# Altium schematic sheet 2-PWR_MANAGE.SchDoc
size A4
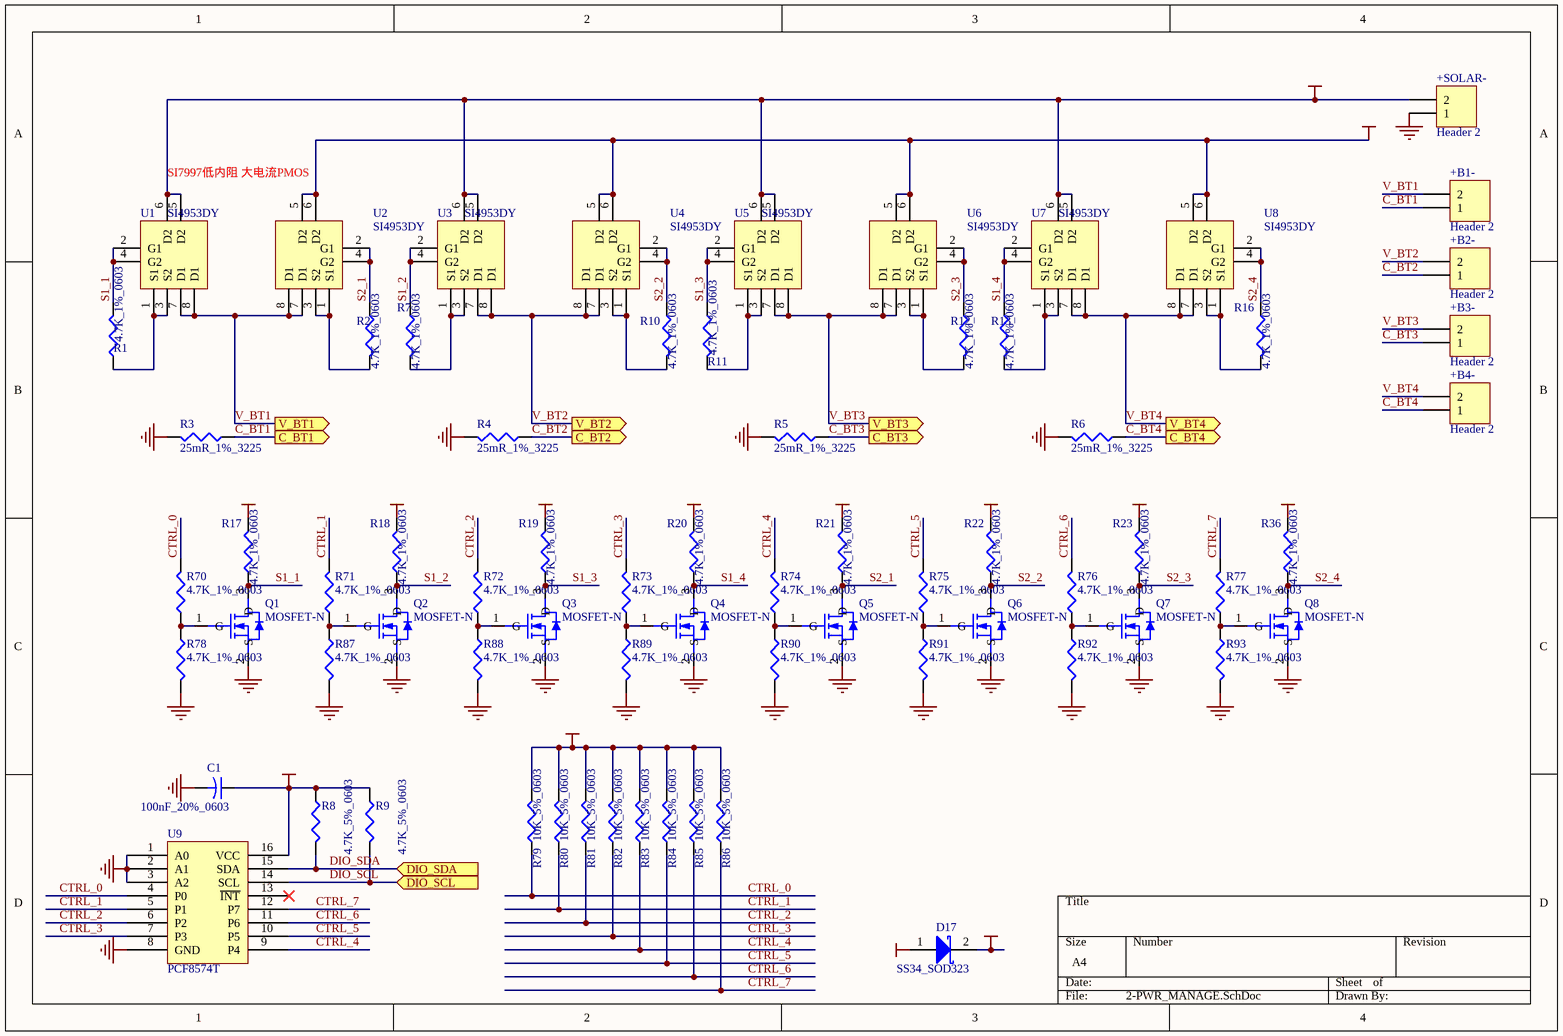
[diagram p0: 2-PWR_MANAGE.SchDoc]

## Parts
+B1-  Header 2  [VH-02H]
+B2-  Header 2  [VH-02H]
+B3-  Header 2  [VH-02H]
+B4-  Header 2  [VH-02H]
+SOLAR-  Header 2  [VH-02H]
C1  100nF_20%_0603  [C1608-0603]
D17  SS34_SOD323  [LED0805]
Q1  MOSFET-N  [SO-G3/C2.5]
Q2  MOSFET-N  [SO-G3/C2.5]
Q3  MOSFET-N  [SO-G3/C2.5]
Q4  MOSFET-N  [SO-G3/C2.5]
Q5  MOSFET-N  [SO-G3/C2.5]
Q6  MOSFET-N  [SO-G3/C2.5]
Q7  MOSFET-N  [SO-G3/C2.5]
Q8  MOSFET-N  [SO-G3/C2.5]
R1  4.7K_1%_0603  [C1608-0603]
R2  4.7K_1%_0603  [C1608-0603]
R3  25mR_1%_3225  [CR6332-2512]
R4  25mR_1%_3225  [CR6332-2512]
R5  25mR_1%_3225  [CR6332-2512]
R6  25mR_1%_3225  [CR6332-2512]
R7  4.7K_1%_0603  [C1608-0603]
R8  4.7K_5%_0603  [C1608-0603]
R9  4.7K_5%_0603  [C1608-0603]
R10  4.7K_1%_0603  [C1608-0603]
R11  4.7K_1%_0603  [C1608-0603]
R12  4.7K_1%_0603  [C1608-0603]
R13  4.7K_1%_0603  [C1608-0603]
R16  4.7K_1%_0603  [C1608-0603]
R17  4.7K_1%_0603  [C1608-0603]
R18  4.7K_1%_0603  [C1608-0603]
R19  4.7K_1%_0603  [C1608-0603]
R20  4.7K_1%_0603  [C1608-0603]
R21  4.7K_1%_0603  [C1608-0603]
R22  4.7K_1%_0603  [C1608-0603]
R23  4.7K_1%_0603  [C1608-0603]
R36  4.7K_1%_0603  [C1608-0603]
R70  4.7K_1%_0603  [C1608-0603]
R71  4.7K_1%_0603  [C1608-0603]
R72  4.7K_1%_0603  [C1608-0603]
R73  4.7K_1%_0603  [C1608-0603]
R74  4.7K_1%_0603  [C1608-0603]
R75  4.7K_1%_0603  [C1608-0603]
R76  4.7K_1%_0603  [C1608-0603]
R77  4.7K_1%_0603  [C1608-0603]
R78  4.7K_1%_0603  [C1608-0603]
R79  10K_5%_0603  [C1608-0603]
R80  10K_5%_0603  [C1608-0603]
R81  10K_5%_0603  [C1608-0603]
R82  10K_5%_0603  [C1608-0603]
R83  10K_5%_0603  [C1608-0603]
R84  10K_5%_0603  [C1608-0603]
R85  10K_5%_0603  [C1608-0603]
R86  10K_5%_0603  [C1608-0603]
R87  4.7K_1%_0603  [C1608-0603]
R88  4.7K_1%_0603  [C1608-0603]
R89  4.7K_1%_0603  [C1608-0603]
R90  4.7K_1%_0603  [C1608-0603]
R91  4.7K_1%_0603  [C1608-0603]
R92  4.7K_1%_0603  [C1608-0603]
R93  4.7K_1%_0603  [C1608-0603]
U1  SI4953DY  [SO-8]
U2  SI4953DY  [SO-8]
U3  SI4953DY  [SO-8]
U4  SI4953DY  [SO-8]
U5  SI4953DY  [SO-8]
U6  SI4953DY  [SO-8]
U7  SI4953DY  [SO-8]
U8  SI4953DY  [SO-8]
U9  PCF8574T  [SOP16_P1.27_B10]

## Ports
C_BT1 (out), C_BT2 (out), C_BT3 (out), C_BT4 (out), DIO_SCL (in), DIO_SDA (in), V_BT1 (out), V_BT2 (out), V_BT3 (out), V_BT4 (out)

## Nets
GND: +SOLAR-.1 C1.2 Q1.2(S) Q2.2(S) Q3.2(S) Q4.2(S) Q5.2(S) Q6.2(S) Q7.2(S) Q8.2(S) R3.2 R4.2 R5.2 R6.2 R78.2 R87.2 R88.2 R89.2 R90.2 R91.2 R92.2 R93.2 U9.1(A0) U9.2(A1) U9.3(A2) U9.8(GND)
VCC_3V3: C1.1 R8.1 R9.1 R79.2 R80.2 R81.2 R82.2 R83.2 R84.2 R85.2 R86.2 U9.16(VCC)
VCC_9V: D17.1(A)
VCC_BAT: U2.5(D2) U2.6(D2) U4.5(D2) U4.6(D2) U6.5(D2) U6.6(D2) U8.5(D2) U8.6(D2)
VCC_CHARGE: +SOLAR-.2 U1.5(D2) U1.6(D2) U3.5(D2) U3.6(D2) U5.5(D2) U5.6(D2) U7.5(D2) U7.6(D2)
VCC_TH: D17.2(K) R17.2 R18.2 R19.2 R20.2 R21.2 R22.2 R23.2 R36.2
C_BT1: +B1-.1 R3.1 ; port C_BT1
C_BT2: +B2-.1 R4.1 ; port C_BT2
C_BT3: +B3-.1 R5.1 ; port C_BT3
C_BT4: +B4-.1 R6.1 ; port C_BT4
CTRL_0: R70.2 R79.1 U9.4(P0)
CTRL_1: R71.2 R80.1 U9.5(P1)
CTRL_2: R72.2 R81.1 U9.6(P2)
CTRL_3: R73.2 R82.1 U9.7(P3)
CTRL_4: R74.2 R83.1 U9.9(P4)
CTRL_5: R75.2 R84.1 U9.10(P5)
CTRL_6: R76.2 R85.1 U9.11(P6)
CTRL_7: R77.2 R86.1 U9.12(P7)
DIO_SCL: R9.2 U9.14(SCL) ; port DIO_SCL
DIO_SDA: R8.2 U9.15(SDA) ; port DIO_SDA
S1_1: Q1.3(D) R1.2 R17.1 U1.2(G1) U1.4(G2)
S1_2: Q2.3(D) R7.1 R18.1 U3.2(G1) U3.4(G2)
S1_3: Q3.3(D) R11.1 R19.1 U5.2(G1) U5.4(G2)
S1_4: Q4.3(D) R13.1 R20.1 U7.2(G1) U7.4(G2)
S2_1: Q5.3(D) R2.1 R21.1 U2.2(G1) U2.4(G2)
S2_2: Q6.3(D) R10.1 R22.1 U4.2(G1) U4.4(G2)
S2_3: Q7.3(D) R12.1 R23.1 U6.2(G1) U6.4(G2)
S2_4: Q8.3(D) R16.1 R36.1 U8.2(G1) U8.4(G2)
V_BT1: +B1-.2 U1.7(D1) U1.8(D1) U2.7(D1) U2.8(D1) ; port V_BT1
V_BT2: +B2-.2 U3.7(D1) U3.8(D1) U4.7(D1) U4.8(D1) ; port V_BT2
V_BT3: +B3-.2 U5.7(D1) U5.8(D1) U6.7(D1) U6.8(D1) ; port V_BT3
V_BT4: +B4-.2 U7.7(D1) U7.8(D1) U8.7(D1) U8.8(D1) ; port V_BT4
NetQ1_1: Q1.1(G) R70.1 R78.1
NetQ2_1: Q2.1(G) R71.1 R87.1
NetQ3_1: Q3.1(G) R72.1 R88.1
NetQ4_1: Q4.1(G) R73.1 R89.1
NetQ5_1: Q5.1(G) R74.1 R90.1
NetQ6_1: Q6.1(G) R75.1 R91.1
NetQ7_1: Q7.1(G) R76.1 R92.1
NetQ8_1: Q8.1(G) R77.1 R93.1
NetR1_1: R1.1 U1.1(S1) U1.3(S2)
NetR2_2: R2.2 U2.1(S1) U2.3(S2)
NetR7_2: R7.2 U3.1(S1) U3.3(S2)
NetR10_2: R10.2 U4.1(S1) U4.3(S2)
NetR11_2: R11.2 U5.1(S1) U5.3(S2)
NetR12_2: R12.2 U6.1(S1) U6.3(S2)
NetR13_2: R13.2 U7.1(S1) U7.3(S2)
NetR16_2: R16.2 U8.1(S1) U8.3(S2)

Not connected (* = marked no-connect by the designer): U9 13(~{INT})*

## Notes on the sheet
- SI7997低内阻 大电流PMOS

## Library data of the parts
+B1- +B2- +B3- +B4- +SOLAR- = Header 2: Header, 2-Pin; LatestRevisionDate: 17-Jul-2002; LatestRevisionNote: Re-released for DXP Platform.; Publisher: Altium Limited
C1 = Cap2: Capacitor; Value: 0.1uF; Published: 23-Sep-2002; Publisher: Altium Limited
D17 = D Schottky: Schottky Diode; Code - JEDEC: DO-214-AA; Published: 8-Jun-2000; Revision: July-2002: Re-released for DXP Platform.; Publisher: Altium Limited
R1 R2 R7-R13 R16-R23 R36 R70-R93 = Res3: Resistor; Value: 1K%5 0603; Published: 8-Jun-2000; Revision: July-2002: Re-released for DXP Platform.; Publisher: Altium Limited
R3-R6 = Res3: Resistor; Value: 150R %5 0603; Published: 8-Jun-2000; Revision: July-2002: Re-released for DXP Platform.; Publisher: Altium Limited